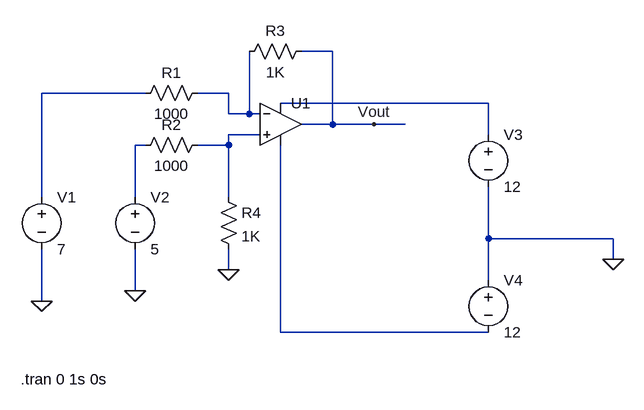
[diagram p0: schematic Substractor_LTSpice.asc]
Substractor_LTSpice.asc, the LTspice schematic file:
Version 4
SHEET 1 900 680
WIRE 448 -16 400 -16
WIRE 160 48 0 48
WIRE 288 48 240 48
WIRE 688 64 368 64
WIRE 288 80 288 48
WIRE 320 80 320 -16
WIRE 320 80 288 80
WIRE 336 80 320 80
WIRE 448 96 448 -16
WIRE 448 96 400 96
WIRE 512 96 448 96
WIRE 560 96 512 96
WIRE 336 112 288 112
WIRE 688 112 688 64
WIRE 160 128 144 128
WIRE 288 128 288 112
WIRE 288 128 240 128
WIRE 0 208 0 48
WIRE 144 208 144 128
WIRE 288 208 288 128
WIRE 688 272 688 192
WIRE 880 272 688 272
WIRE 880 304 880 272
WIRE 288 320 288 288
WIRE 688 336 688 272
WIRE 144 352 144 288
WIRE 0 368 0 288
WIRE 368 416 368 128
WIRE 688 416 368 416
FLAG 880 304 0
FLAG 512 96 Vout
FLAG 288 320 0
FLAG 144 352 0
FLAG 0 368 0
SYMBOL voltage 0 192 R0
WINDOW 123 0 0 Left 2
WINDOW 39 0 0 Left 2
SYMATTR InstName V1
SYMATTR Value 7
SYMBOL voltage 144 192 R0
WINDOW 123 0 0 Left 2
WINDOW 39 0 0 Left 2
SYMATTR InstName V2
SYMATTR Value 5
SYMBOL res 256 32 R90
WINDOW 0 0 56 VBottom 2
WINDOW 3 32 56 VTop 2
SYMATTR InstName R1
SYMATTR Value 1000
SYMBOL res 256 112 R90
WINDOW 0 0 56 VBottom 2
WINDOW 3 32 56 VTop 2
SYMATTR InstName R2
SYMATTR Value 1000
SYMBOL Opamps\\UniversalOpamp2 368 96 R0
SYMATTR InstName U1
SYMBOL res 416 -32 R90
WINDOW 0 0 56 VBottom 2
WINDOW 3 32 56 VTop 2
SYMATTR InstName R3
SYMATTR Value 1K
SYMBOL res 272 192 R0
SYMATTR InstName R4
SYMATTR Value 1K
SYMBOL voltage 688 96 R0
WINDOW 123 0 0 Left 2
WINDOW 39 0 0 Left 2
SYMATTR InstName V3
SYMATTR Value 12
SYMBOL voltage 688 320 R0
WINDOW 123 0 0 Left 2
WINDOW 39 0 0 Left 2
SYMATTR InstName V4
SYMATTR Value 12
TEXT -32 488 Left 2 !.tran 0 1s 0s

The netlist it stands for:
* Substractor_LTSpice.asc
V1 N001 0 7
V2 N005 0 5
R1 N002 N001 1000
R2 N004 N005 1000
XU1 N004 N002 N003 N006 Vout level.2 Avol=1Meg GBW=10Meg Slew=10Meg ilimit=25m rail=0 Vos=0 phimargin=45 en=0 enk=0 in=0 ink=0 Rin=500Meg  ; pins IN+ IN- V+ V- OUT
R3 Vout N002 1K
R4 N004 0 1K
V3 N003 0 12
V4 0 N006 12
.tran 0 1s 0s
.lib UniversalOpamps2.sub
.backanno
.end